# Altium schematic sheet Teensy and ICs.SchDoc: NER A Size Template
size Tabloid; ApprovedBy: WS; DrawnBy: Cameron Gordon; Address4: X.X.X; Revision: 1; SheetNumber: 1; SheetTotal: 3
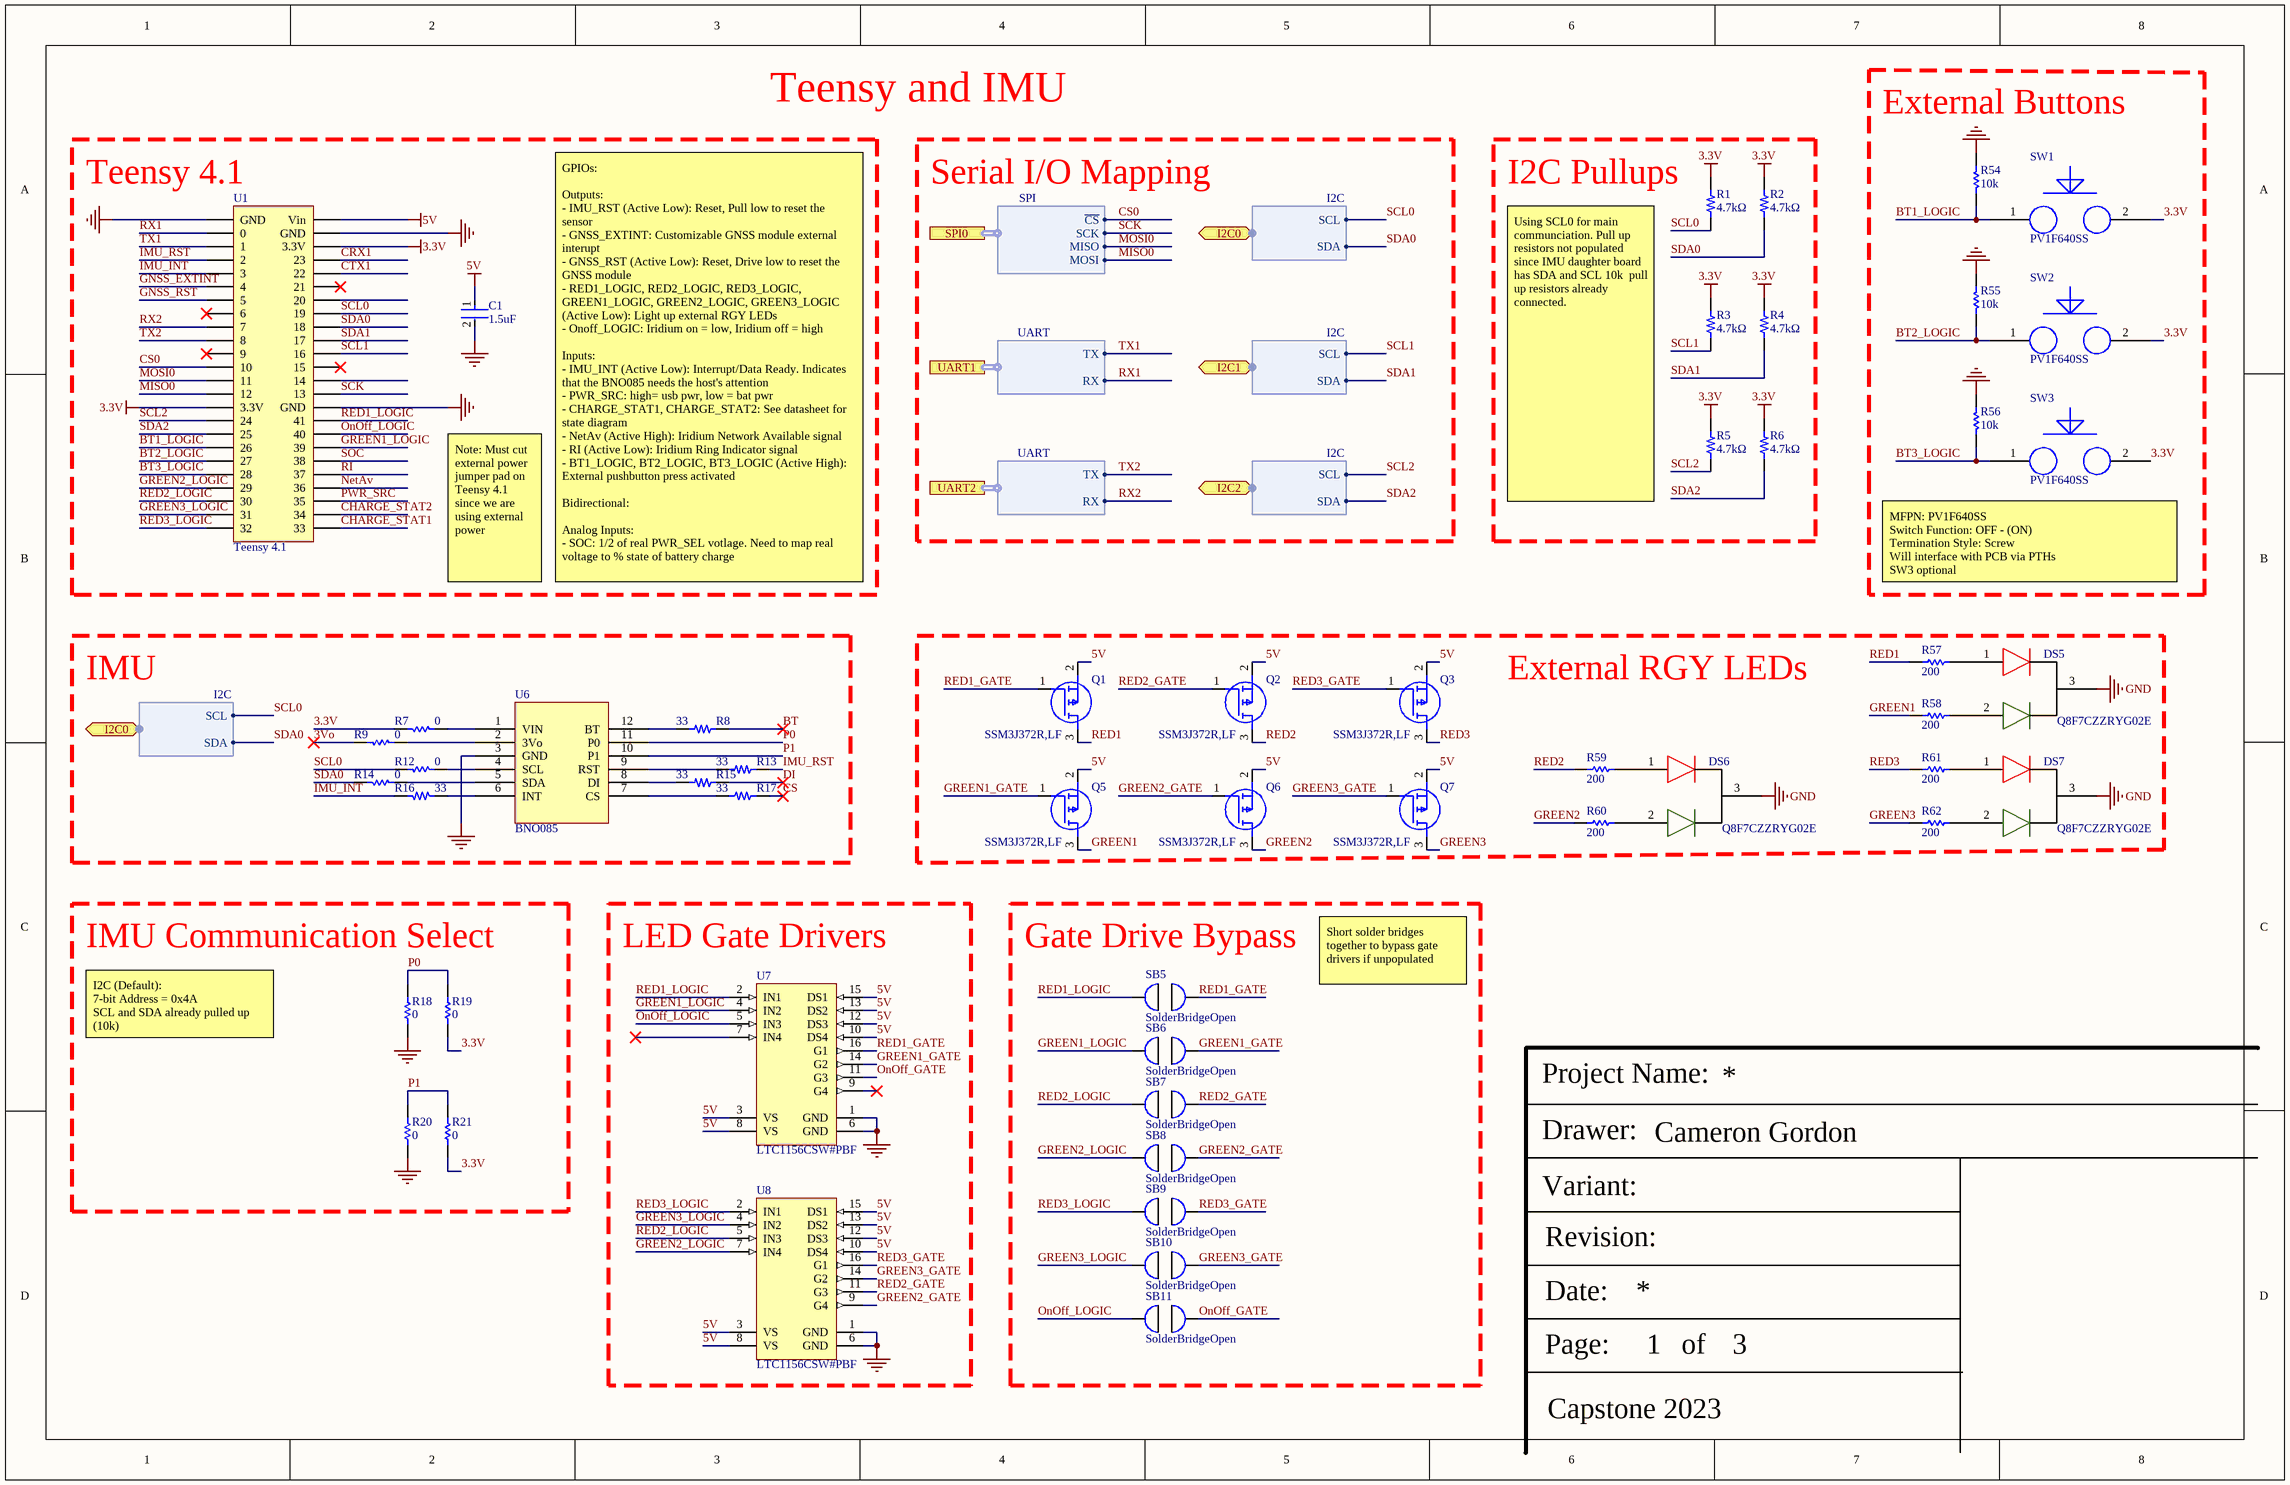
[diagram p0: Teensy and ICs.SchDoc]

## Parts
C1  Capacitance: 1.5uF  [FP-C2012-125-0_2-MFG]  (hidden comment: C2012X7R1E155K125AC)
DS5  Q8F7CZZRYG02E  [Q8F7CZZRYG02E]
DS6  Q8F7CZZRYG02E  [Q8F7CZZRYG02E]
DS7  Q8F7CZZRYG02E  [Q8F7CZZRYG02E]
Q1  SSM3J372R,LF  [SSM3J372RLF]
Q2  SSM3J372R,LF  [SSM3J372RLF]
Q3  SSM3J372R,LF  [SSM3J372RLF]
Q5  SSM3J372R,LF  [SSM3J372RLF]
Q6  SSM3J372R,LF  [SSM3J372RLF]
Q7  SSM3J372R,LF  [SSM3J372RLF]
R1  Resistance: 4.7kΩ  [0603 Resistor]  (hidden comment: ERJ-3GEYJ472V)
R2  Resistance: 4.7kΩ  [0603 Resistor]  (hidden comment: ERJ-3GEYJ472V)
R3  Resistance: 4.7kΩ  [0603 Resistor]  (hidden comment: ERJ-3GEYJ472V)
R4  Resistance: 4.7kΩ  [0603 Resistor]  (hidden comment: ERJ-3GEYJ472V)
R5  Resistance: 4.7kΩ  [0603 Resistor]  (hidden comment: ERJ-3GEYJ472V)
R6  Resistance: 4.7kΩ  [0603 Resistor]  (hidden comment: ERJ-3GEYJ472V)
R7  Resistance: 0  [RESC1608X55X25ML10T15]  (hidden comment: RC0603JR-070RL)
R8  Resistance: 33  [0603 Resistor]  (hidden comment: CRGCQ0603J33R)
R9  Resistance: 0  [RESC1608X55X25ML10T15]  (hidden comment: RC0603JR-070RL)
R12  Resistance: 0  [RESC1608X55X25ML10T15]  (hidden comment: RC0603JR-070RL)
R13  Resistance: 33  [0603 Resistor]  (hidden comment: CRGCQ0603J33R)
R14  Resistance: 0  [RESC1608X55X25ML10T15]  (hidden comment: RC0603JR-070RL)
R15  Resistance: 33  [0603 Resistor]  (hidden comment: CRGCQ0603J33R)
R16  Resistance: 33  [0603 Resistor]  (hidden comment: CRGCQ0603J33R)
R17  Resistance: 33  [0603 Resistor]  (hidden comment: CRGCQ0603J33R)
R18  Resistance: 0  [RESC1608X55X25ML10T15]  (hidden comment: RC0603JR-070RL)
R19  Resistance: 0  [RESC1608X55X25ML10T15]  (hidden comment: RC0603JR-070RL)
R20  Resistance: 0  [RESC1608X55X25ML10T15]  (hidden comment: RC0603JR-070RL)
R21  Resistance: 0  [RESC1608X55X25ML10T15]  (hidden comment: RC0603JR-070RL)
R54  Resistance: 10k  [RESC1609X55X30LL15T15]  (hidden comment: ERJ3EKF1002V)
R55  Resistance: 10k  [RESC1609X55X30LL15T15]  (hidden comment: ERJ3EKF1002V)
R56  Resistance: 10k  [RESC1609X55X30LL15T15]  (hidden comment: ERJ3EKF1002V)
R57  value 200  [RESC2013X60X35ML10T20]  (hidden comment: RC0805JR-07200RL)
R58  value 200  [RESC2013X60X35ML10T20]  (hidden comment: RC0805JR-07200RL)
R59  value 200  [RESC2013X60X35ML10T20]  (hidden comment: RC0805JR-07200RL)
R60  value 200  [RESC2013X60X35ML10T20]  (hidden comment: RC0805JR-07200RL)
R61  value 200  [RESC2013X60X35ML10T20]  (hidden comment: RC0805JR-07200RL)
R62  value 200  [RESC2013X60X35ML10T20]  (hidden comment: RC0805JR-07200RL)
SB5  SolderBridgeOpen  [SOLDERBRIDGEOPEN]
SB6  SolderBridgeOpen  [SOLDERBRIDGEOPEN]
SB7  SolderBridgeOpen  [SOLDERBRIDGEOPEN]
SB8  SolderBridgeOpen  [SOLDERBRIDGEOPEN]
SB9  SolderBridgeOpen  [SOLDERBRIDGEOPEN]
SB10  SolderBridgeOpen  [SOLDERBRIDGEOPEN]
SB11  SolderBridgeOpen  [SOLDERBRIDGEOPEN]
SW1  PV1F640SS  [PV1F640SS-Footprint-1]
SW2  PV1F640SS  [PV1F640SS-Footprint-1]
SW3  PV1F640SS  [PV1F640SS-Footprint-1]
U1  Teensy 4.1  [Teensy_4.1]
U6  BNO085  [BNO085]
U7  LTC1156CSW#PBF  [LT-SW-16_L]
U8  LTC1156CSW#PBF  [LT-SW-16_L]

## Blocks framed on the sheet
External Buttons: R54-R56 SW1-SW3
Teensy 4.1: C1 U1
I2C Pullups: R1-R6
IMU: R7-R9 R12-R17 U6
External RGY LEDs: DS5-DS7 Q1-Q3 Q5-Q7 R57-R62
IMU Communication Select: R18-R21
LED Gate Drivers: U7 U8
Gate Drive Bypass: SB5-SB11

## Ports
I2C0 (bidir, harness I2C), I2C1 (bidir, harness I2C), I2C2 (bidir, harness I2C), SPI0 (harness SPI), UART1 (harness UART), UART2 (harness UART)

## Harnesses
SPI: MOSI, MISO, ~{CS}, SCK
UART: TX, RX
I2C: SCL, SDA

## Nets
3.3V: R1.2 R2.2 R3.2 R4.2 R5.2 R6.2 R7.1 R19.1 R21.1 SW1.2 SW2.2 SW3.2 U1.15(3.3V) U1.46(3.3V)
5V: C1.1 Q1.2(S) Q2.2(S) Q3.2(S) Q5.2(S) Q6.2(S) Q7.2(S) U1.48(Vin) U7.3(VS) U7.8(VS) U7.10(DS4) U7.12(DS3) U7.13(DS2) U7.15(DS1) U8.3(VS) U8.8(VS) U8.10(DS4) U8.12(DS3) U8.13(DS2) U8.15(DS1)
GND: C1.2 DS5.3 DS6.3 DS7.3 R18.1 R20.1 R54.1 R55.1 R56.1 U1.1(GND) U1.34(GND) U1.47(GND) U6.3(GND) U7.1(GND) U7.6(GND) U8.1(GND) U8.6(GND)
3Vo: R9.1
BT: R8.2
BT1_LOGIC: R54.2 SW1.1 U1.18(26)
BT2_LOGIC: R55.2 SW2.1 U1.19(27)
BT3_LOGIC: R56.2 SW3.1 U1.20(28)
CHARGE_STAT1: U1.25(33)
CHARGE_STAT2: U1.26(34)
CRX1: U1.45(23)
CS: R17.2
CS0: U1.12(10) ; port SPI0.~{CS}
CTX1: U1.44(22)
DI: R15.2
GNSS_EXTINT: U1.6(4)
GNSS_RST: U1.7(5)
GREEN1: Q5.3(D) R58.2
GREEN1_GATE: Q5.1(G) SB6.1 U7.14(G2)
GREEN1_LOGIC: SB6.2 U1.31(39) U7.4(IN2)
GREEN2: Q6.3(D) R60.2
GREEN2_GATE: Q6.1(G) SB8.1 U8.9(G4)
GREEN2_LOGIC: SB8.2 U1.21(29) U8.7(IN4)
GREEN3: Q7.3(D) R62.2
GREEN3_GATE: Q7.1(G) SB10.1 U8.14(G2)
GREEN3_LOGIC: SB10.2 U1.23(31) U8.4(IN2)
IMU_INT: R16.2 U1.5(3)
IMU_RST: R13.2 U1.4(2)
MISO0: U1.14(12) ; port SPI0.MOSI
MOSI0: U1.13(11) ; port SPI0.MISO
NetAv: U1.28(36)
OnOff_GATE: SB11.1 U7.11(G3)
OnOff_LOGIC: SB11.2 U1.32(40) U7.5(IN3)
P0: R18.2 R19.2 U6.11(P0)
P1: R20.2 R21.2 U6.10(P1)
PWR_SRC: U1.27(35)
RED1: Q1.3(D) R57.2
RED1_GATE: Q1.1(G) SB5.1 U7.16(G1)
RED1_LOGIC: SB5.2 U1.33(41) U7.2(IN1)
RED2: Q2.3(D) R59.2
RED2_GATE: Q2.1(G) SB7.1 U8.11(G3)
RED2_LOGIC: SB7.2 U1.22(30) U8.5(IN3)
RED3: Q3.3(D) R61.2
RED3_GATE: Q3.1(G) SB9.1 U8.16(G1)
RED3_LOGIC: SB9.2 U1.24(32) U8.2(IN1)
RI: U1.29(37)
RX1: U1.2(0) ; port UART1.RX
RX2: U1.9(7) ; port UART2.RX
SCK: U1.35(13) ; port SPI0.SCK
SCL0: R1.1 R12.1 U1.41(19) ; port I2C0.SCL
SCL1: R3.1 U1.38(16) ; port I2C1.SCL
SCL2: R5.1 U1.16(24) ; port I2C2.SCL
SDA0: R2.1 R14.1 U1.40(18) ; port I2C0.SDA
SDA1: R4.1 U1.39(17) ; port I2C1.SDA
SDA2: R6.1 U1.17(25) ; port I2C2.SDA
SOC: U1.30(38)
TX1: U1.3(1) ; port UART1.TX
TX2: U1.10(8) ; port UART2.TX
NetDS5_1: DS5.1 R57.1
NetDS5_2: DS5.2 R58.1
NetDS6_1: DS6.1 R59.1
NetDS6_2: DS6.2 R60.1
NetDS7_1: DS7.1 R61.1
NetDS7_2: DS7.2 R62.1
NetR7_2: R7.2 U6.1(VIN)
NetR8_1: R8.1 U6.12(BT)
NetR9_2: R9.2 U6.2(3Vo)
NetR12_2: R12.2 U6.4(SCL)
NetR13_1: R13.1 U6.9(RST)
NetR14_2: R14.2 U6.5(SDA)
NetR15_1: R15.1 U6.8(DI)
NetR16_1: R16.1 U6.6(INT)
NetR17_1: R17.1 U6.7(CS)

Not connected (* = marked no-connect by the designer): U1 8(6)* 11(9)* 36(14) 37(15)* 42(20) 43(21)*; U7 7(IN4)* 9(G4)*

## Notes on the sheet
- Teensy and IMU
- Serial I/O Mapping
- Using SCL0 for main communciation. Pull up resistors not populated since IMU daughter board has SDA and SCL 10k  pull up resistors already connected.
- Note: Must cut external power jumper pad on Teensy 4.1 since we are using external power
- GPIOs:
  Outputs:
  - IMU_RST (Active Low): Reset, Pull low to reset the sensor
  - GNSS_EXTINT: Customizable GNSS module external interupt
  - GNSS_RST (Active Low): Reset, Drive low to reset the GNSS module
  - RED1_LOGIC, RED2_LOGIC, RED3_LOGIC, GREEN1_LOGIC, GREEN2_LOGIC, GREEN3_LOGIC (Active Low): Light up external RGY LEDs
  - Onoff_LOGIC: Iridium on = low, Iridium off = high
  Inputs:
  - IMU_INT (Active Low): Interrupt/Data Ready. Indicates that the BNO085 needs the host's attention
  - PWR_SRC: high= usb pwr, low = bat pwr
  - CHARGE_STAT1, CHARGE_STAT2: See datasheet for state diagram
  - NetAv (Active High): Iridium Network Available signal
  - RI (Active Low): Iridium Ring Indicator signal
  - BT1_LOGIC, BT2_LOGIC, BT3_LOGIC (Active High): External pushbutton press activated
  Bidirectional:
  Analog Inputs:
  - SOC: 1/2 of real PWR_SEL votlage. Need to map real voltage to % state of battery charge
- (near SW3) MFPN: PV1F640SS
  Switch Function: OFF - (ON)
  Termination Style: Screw
  Will interface with PCB via PTHs
  SW3 optional
- I2C (Default):
  7-bit Address = 0x4A
  SCL and SDA already pulled up (10k)
- Short solder bridges together to bypass gate drivers if unpopulated
- Project Name:
- Drawer:
- Variant:
- Revision:
- Date:
- Page:
- of
- Capstone 2023

## Library data of the parts
C1 = CMP-08246-004820-1: Multilayer Ceramic Capacitors 1.5μF ±10% 25V X7R SMD 0805; Case Code (Imperial): 0805; Min Operating Temperature: -55°C; Termination: SMD/SMT; Dielectric Material: Ceramic; Weight: 0.000194oz; Height: 1.25mm; Width: 0.049inch; Dielectric: X7R; Voltage Rating: 25V; Max Operating Temperature: 125°C; Mount: Surface Mount; Tolerance: 10%; Length: 0.079inch; Voltage Rating (DC): 25V; Case Code (Metric): 2012; Resistor Type: Ceramic; Thickness: 0.057inch; RoHS Compliant: Yes; Case/Package: 0805; Lead Free: Lead Free; Package Quantity: 1; Packaging: Tape and Reel
Q1-Q3 Q5-Q7 = SSM3J372R,LF: MOSFET (P-Channel); Manufacturer_Name: Toshiba; Datasheet Link: https://toshiba.semicon-storage.com/ap-en/semiconductor/product/mosfets/detail.SSM3J372R.html; Height: 0.88mm; Manufacturer_Part_Number: SSM3J372R,LF; Mouser Part Number: 757-SSM3J372RLF; Mouser Price/Stock: https://www.mouser.co.uk/ProductDetail/Toshiba/SSM3J372RLF?qs=u16ybLDytRbJaSMlwq9MLA%3D%3D; Arrow Part Number: SSM3J372R,LF; Arrow Price/Stock: https://www.arrow.com/en/products/ssm3j372rlf/toshiba?region=nac
R1-R6 = CMP-001-0036-2: 0603 Resistor, 4.7kΩ, ±5%, 0.1W; Power Rating: 100mW; Tolerance: 5%; Package: 0603
R7 R9 R12 R14 R18-R21 = CMP-2100-03667-1: Chip Resistor, 0 Ohm, +/- 5%, 0.1 W, -55 to 155 degC, 0603 (1608 Metric), RoHS, Tape and Reel; Manufacturer: Yageo; Temperature Coefficient: 200ppm/degreesC; Voltage Rating: 50V; Power Rating: 100mW; Width: 0.8mm; Max Operating Temperature: 155degC; Tolerance: 5%; Package Reference: 0603; Height: 0.45mm; Depth: 0.8mm; Package Description: 2-Pin Surface Mount Device, Body 1.6 x 0.8 mm; Termination: SMD/SMT; Package Quantity: 5000; Case/Package: 0603; Case Code (Imperial): 0603; Radiation Hardening: No; Number of Pins: 2; Length: 1.6mm; Lead Free: LeadFree; Voltage Rating (DC): 50V; Military Standard: Not; Datasheet URL: http://www.yageo.com/NewPortal/yageodocoutput?fileName=/pdf/R-Chip/PYu-RC_Group_51_RoHS_L_5.pdf; Manufacturer URL: http://www.yageo.com/; Packaging: TapeandReel; Case Code (Metric): 1608; Min Operating Temperature: -55degC; Composition: ThickFilm; RoHSCompliant: true; Contact Plating: Tin; Datasheet Version: Rev. 5, 10/2016; REACH SVHC: NoSVHC
R8 R13 R15-R17 = CMP-00148-2: Res Thick Film 0603 33 Ohm 5% 0.1W(1/10W) ±200ppm/C Pad SMD Automotive T/R; Power Rating: 100mW; Package: 0603; Tolerance: 5%
R54-R56 = CMP-1012-00623-3: Chip Resistor, 10 KOhm, +/- 1%, 0.1 W, -55 to 155 degC, 0603 (1608 Metric), RoHS, Tape and Reel; Manufacturer: Panasonic; Voltage Rating: 75V; Case\/Package: 0603; Power Rating: 100mW; Temperature Coefficient: 100ppm\/degreesC; Number of Pins: 2; Package Reference: 603; Depth: 0.8mm; Mount: SurfaceMount; Package Description: 2-Pin Surface Mount Device, Body 1.6 x 0.85 mm; Datasheet Version: 02/2017; Length: 1.6mm; Lead Free: LeadFree; Height: 0.45mm; Number of Terminations: 2; Max Power Dissipation: 100mW; Min Operating Temperature: -55degC; Datasheet URL: https://industrial.panasonic.com/cdbs/www-data/pdf/RDA0000/AOA0000C304.pdf; Termination: SMD/SMT; Case Code (Metric): 1608; Case Code (Imperial): 0603; Tolerance: 1%; Max Operating Temperature: 155degC; RoHSCompliant: true; Voltage Rating (DC): 75V; Radiation Hardening: No; Packaging: TapeandReel; Composition: ThickFilm; Mounting Technology: SurfaceMount; Manufacturer URL: http://www.panasonic.com/; Width: 0.031inch; REACH SVHC: NoSVHC; Contact Plating: Tin; Military Standard: Not; Package Quantity: 1
R57-R62 = CMP-2001-01354-1: Manufacturer: Yageo; Part Number: RC0805JR-07200RL
SW1-SW3 = CMP-011-00013-1: Pushbutton Switch; Voltage Rating: 48V; Current Rating: 2A; Movement Type: Momentary, push button, slide, toggle, etc; Throw Configuration: DPST, SPST, etc
U1 = CMP-00040-2: Teensy 4.1 w/ Headers
U6 = BNO085: Adafruit 9-DOF Orientation IMU Fusion Breakout - BNO085
U7 U8 = CMP-0479-00627-1: Quad High Side Micropower MOSFET Driver with Internal Charge Pump, 22 V Vin MAX, 16-pin SOIC (SW-16), 0 to 70 degC, Pb-Free; Manufacturer: Linear Technology; DatasheetVersion: Rev. A; RoHS: TRUE; ComponentLink1URL: http://www.linear.com/; ComponentLink3URL: http://www.linear.com/docs/en/packaging/SO_16_05-08-1620.pdf; PackageDescription: 16-Pin Plastic Small Outline, Body 10.30 x 7.49 mm, Pitch 1.27 mm; Mounting Technology: Surface Mount; ComponentLink3Description: Package Specification; PackageReference: SW-16; ComponentLink2Description: Datasheet; PartNumber: LTC1156CSW#PBF; ComponentLink2URL: http://cds.linear.com/docs/en/datasheet/lt1156.pdf; PackageVersion: Jun-10; ComponentLink1Description: Manufacturer URL